# EAGLE schematic new inverter (EAGLE 9.3.2)
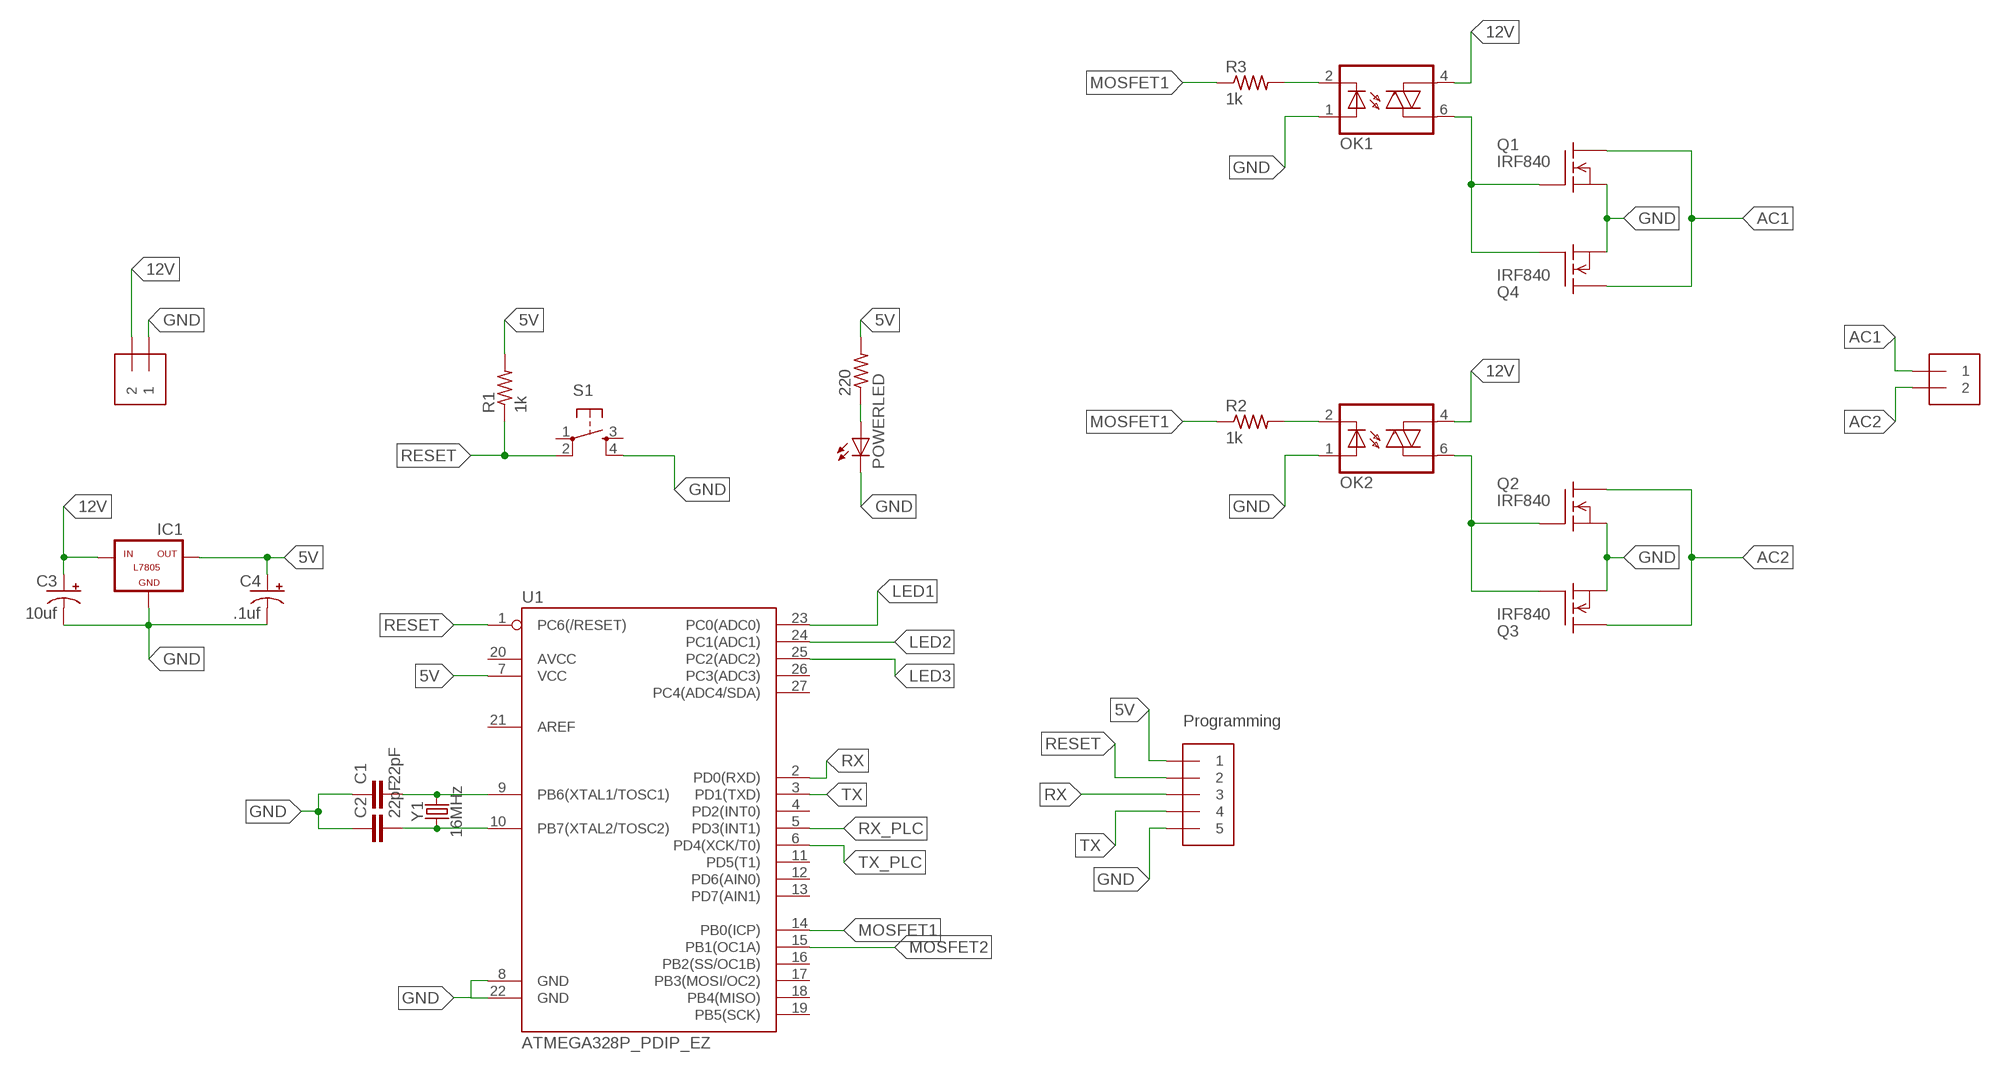
[diagram p0: schematic, sheet 1]

## Parts
220  R-US_0204/5  [0204/5]
C1  22pF  22PF-PTH-2.54MM-200V-5%  [CAP-PTH-2.54]
C2  22pF  22PF-PTH-2.54MM-200V-5%  [CAP-PTH-2.54]
C3  10uf  CPOL-USE5-5  [E5-5]
C4  .1uf  CPOL-USE5-5  [E5-5]
IC1  L7805  [78XXL]
J1  1X2-3.5MM  [1X2-3.5MM]
J2  1X5  [1X05-3.5MM]
J3  1X2-3.5MM  [1X2-3.5MM]
OK1  MOC3021M  [DIL06]
OK2  MOC3021M  [DIL06]
POWERLED  LED5MM  [LED5MM]
Q1  IRF840  [TO220]
Q2  IRF840  [TO220]
Q3  IRF840  [TO220]
Q4  IRF840  [TO220]
R1  1k  R-US_0204/5  [0204/5]
R2  1k  R-US_0204/5  [0204/5]
R3  1k  R-US_0204/5  [0204/5]
S1  TAC_SWITCHPTH  [TACTILE-PTH]
U1  ATMEGA328P_PDIP_EZ  [DIP28-SIMON-KIT]
Y1  16MHz  CRYSTAL-16MHZPTH-HC49US  [HC49US]

## Nets
5V: 220.2 C4.+ IC1.OUT J2.1 R1.2 U1.7(VCC)
12V: C3.+ IC1.IN J1.2 OK1.4(A1) OK2.4(A1)
AC1: J3.1 Q1.2(D) Q4.2(D)
AC2: J3.2 Q2.2(D) Q3.2(D)
GND: C1.1 C2.1 C3.- C4.- IC1.GND J1.1 J2.5 OK1.1(A) OK2.1(A) POWERLED.K(C) Q1.3(S) Q2.3(S) Q3.3(S) Q4.3(S) S1.4 U1.8(GND) U1.22(GND)
LED1: U1.23(PC0(ADC0))
LED2: U1.24(PC1(ADC1))
LED3: U1.25(PC2(ADC2))
MOSFET1: R2.1 R3.1 U1.14(PB0(ICP))
MOSFET2: U1.15(PB1(OC1A))
N$1: 220.1 POWERLED.A
N$2: C1.2 U1.9(PB6(XTAL1/TOSC1)) Y1.2
N$3: C2.2 U1.10(PB7(XTAL2/TOSC2)) Y1.1
N$4: OK2.6(A2) Q2.1(G) Q3.1(G)
N$5: OK1.6(A2) Q1.1(G) Q4.1(G)
N$8: OK2.2(C) R2.2
N$9: OK1.2(C) R3.2
RESET: J2.2 R1.1 S1.2 U1.1(PC6(/RESET))
RX: J2.3 U1.2(PD0(RXD))
RX_PLC: U1.5(PD3(INT1))
TX: J2.4 U1.3(PD1(TXD))
TX_PLC: U1.6(PD4(XCK/T0))
Unconnected: S1.1 S1.3 U1.4(PD2(INT0)) U1.11(PD5(T1)) U1.12(PD6(AIN0)) U1.13(PD7(AIN1)) U1.16(PB2(SS/OC1B)) U1.17(PB3(MOSI/OC2)) U1.18(PB4(MISO)) U1.19(PB5(SCK)) U1.20(AVCC) U1.21(AREF) U1.26(PC3(ADC3)) U1.27(PC4(ADC4/SDA))

## Notes on the sheet
- Programming

## Library data of the parts
220 R1-R3 = adafruit:R-US_: RESISTOR, American symbol
C1 C2 = SparkFun-Capacitors:22PF: 22pF ceramic capacitors A capacitor is a passive two-terminal electrical component used to store electrical energy temporarily in an electric field.; PROD_ID: CAP-09128
C3 C4 = adafruit:CPOL-US: POLARIZED CAPACITOR, American symbol
IC1 = tango:L7805: VOLTAGE REGULATOR
J1 J3 = adafruit:1X2: 3.5mm Terminal block http://www.ladyada.net/library/pcb/eaglelibrary.html
J2 = adafruit:1X5
OK1 OK2 = optocoupler-2:MOC30*M: RANDOM-PHASE OPTOISOLATORS TRIAC DRIVER OUTPUT Source: http://www.fairchildsemi.com MOC3020-M.pdf
POWERLED = adafruit:LED: LED OSRAM: - CHIPLED LG R971, LG N971, LY N971, LG Q971, LY Q971, LO R971, LY R971 LH N974, LH R974 LS Q976, LO Q976, LY Q976 LO Q996 - Hyper CHIPLED LW Q18S LB Q993, LB Q99A, LB R99A - SideLED LS A670, LO A670, LY A670, LG A670, LP A670 LB A673, LV A673, LT A673, LW A673 LH A674 LY A675 LS A676, LA A676, LO A676, LY A676, LW A676 LS A679, LY A679, LG A679 - Hyper Micro SIDELED® LS Y876, LA Y876, LO Y876, LY Y876 LT Y87S - SmartLED LW L88C, LW L88S LB L89C, LB L89S, LG L890 LS L89K, LO L89K, LY L89K LS L896, LA L896, LO L896, LY L896 - TOPLED LS T670, LO T670, LY T670, LG T670, LP T670 LSG T670, LSP T670, LSY T670, LOP T670, LYG T670 LG T671, LOG T671, LSG T671 LB T673, LV T673, LT T673, LW T673 LH T674 LS T676, LA T676, LO T676, LY T676, LB T676, LH T676, LSB T676, LW T676 LB T67C, LV T67C, LT T67C, LS T67K, LO T67K, LY T67K, LW E67C LS E67B, LA E67B, LO E67B, LY E67B, LB E67C, LV E67C, LT E67C LW T67C LS T679, LY T679, LG T679 LS T770, LO T770, LY T770, LG T770, LP T770 LB T773, LV T773, LT T773, LW T773 LH T774 LS E675, LA E675, LY E675, LS T675 LS T776, LA T776, LO T776, LY T776, LB T776 LHGB T686 LT T68C, LB T68C - Hyper Mini TOPLED® LB M676 - Mini TOPLED Santana® LG M470 LS M47K, LO M47K, LY M47K Source: http://www.osram.convergy.de/
Q1-Q4 = transistor-fet:IRF840: N-Channel Enhancement MOSFET (HEXFET); 500V; 8A; 0,85Ohm
S1 = SparkFun-Retired:TAC_SWITCH: Momentary Switch Button commonly used for reset or general input. Spark Fun Electronics SKU : COM-00097 SMT- SWCH-08247
U1 = SparkFun-IC-Microcontroller:ATMEGA328P_PDIP_EZ: Keyed ATMEGA328 DIP This is a version of the DIP package with pin 28 clipped to prevent reverse insertion. See regular 328 for product references.
Y1 = SparkFun-Clocks:CRYSTAL-16MHZ: 16MHz Crystal Digikey Example <http://www.digikey.com/product-search/en?keywords=535-9122-1-ND> Frequency: 16MHz Frequency Stability: ±50ppm Frequency Tolerance: ±20ppm Load Capacitance: 18pF SparkFun Products: Pro Micro -5V/16MHz <https://www.sparkfun.com/products/12640> SparkFun Serial Enabled LCD Kit <https://www.sparkfun.com/products/10097>; PROD_ID: XTAL-08181; SF_ID: COM-00536